# EAGLE design board (EAGLE 7.2.0)
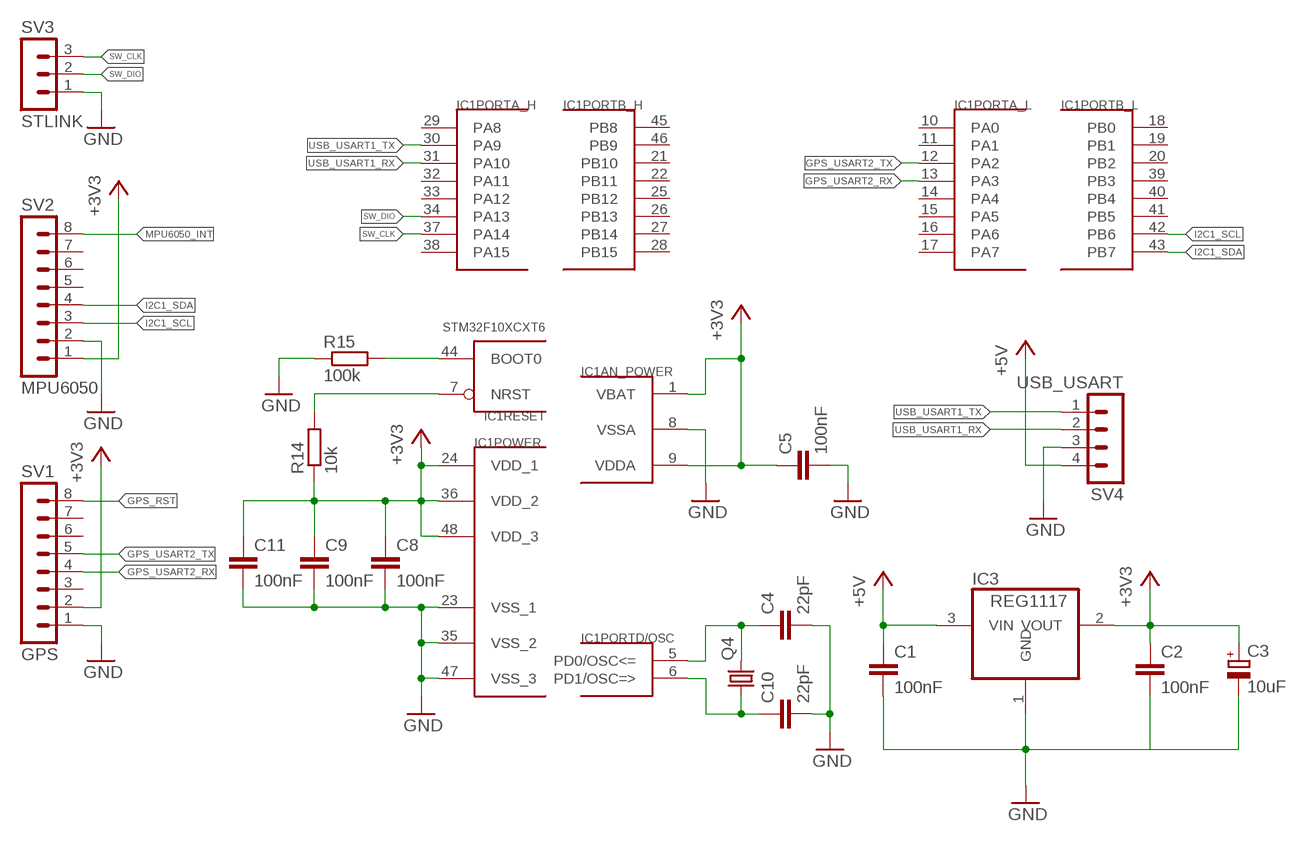
[diagram p0: schematic, sheet 1]

## Parts
C1  100nF  C-EUC0805  [C0805]
C2  100nF  C-EUC0805  [C0805]
C3  10uF  CPOL-EUC/6032-28W  [C/6032-28W]
C4  22pF  C-EUC0805  [C0805]
C5  100nF  C-EUC0603  [C0603]
C8  100nF  C-EUC0805  [C0805]
C9  100nF  C-EUC0805  [C0805]
C10  22pF  C-EUC0805  [C0805]
C11  100nF  C-EUC0805  [C0805]
IC1  STM32F10XCXT6  [TQFP48]
IC3  REG1117  [SOT223]
Q4  CRYSTALHC49UP  [HC49UP]
R14  10k  R-EU_M0805  [M0805]
R15  100k  R-EU_M0805  [M0805]
SV1  GPS  MA08-1  [MA08-1]
SV2  MPU6050  MA08-1  [MA08-1]
SV3  STLINK  MA03-1  [MA03-1]
SV4  USB_USART  MA04-1  [MA04-1]

## Nets
+3V3: C2.1 C3.+ C5.1 C8.1 C9.1 C11.1 IC1.1(AN_POWER:VBAT) IC1.9(AN_POWER:VDDA) IC1.24(POWER:VDD_1) IC1.36(POWER:VDD_2) IC1.48(POWER:VDD_3) IC3.2(VOUT) R14.1 SV1.2 SV2.1
+5V: C1.1 IC3.3(VIN) SV4.4
GND: C1.2 C2.2 C3.- C4.2 C5.2 C8.2 C9.2 C10.2 C11.2 IC1.8(AN_POWER:VSSA) IC1.23(POWER:VSS_1) IC1.35(POWER:VSS_2) IC1.47(POWER:VSS_3) IC3.1(GND) R15.1 SV1.1 SV2.2 SV3.1 SV4.3
GPS_RST: SV1.8
GPS_USART2_RX: IC1.13(PORTA_L:PA3) SV1.4
GPS_USART2_TX: IC1.12(PORTA_L:PA2) SV1.5
I2C1_SCL: IC1.42(PORTB_L:PB6) SV2.3
I2C1_SDA: IC1.43(PORTB_L:PB7) SV2.4
MPU6050_INT: SV2.8
N$3: C4.1 IC1.5(PORTD/OSC:PD0/OSC<=) Q4.2
N$13: IC1.7(RESET:NRST) R14.2
N$18: C10.1 IC1.6(PORTD/OSC:PD1/OSC=>) Q4.1
N$27: IC1.44(RESET:BOOT0) R15.2
SW_CLK: IC1.37(PORTA_H:PA14) SV3.3
SW_DIO: IC1.34(PORTA_H:PA13) SV3.2
USB_USART1_RX: IC1.31(PORTA_H:PA10) SV4.2
USB_USART1_TX: IC1.30(PORTA_H:PA9) SV4.1
Unconnected: IC1.2(PORTC:PC13) IC1.3(PORTC:PC14) IC1.4(PORTC:PC15) IC1.10(PORTA_L:PA0) IC1.11(PORTA_L:PA1) IC1.14(PORTA_L:PA4) IC1.15(PORTA_L:PA5) IC1.16(PORTA_L:PA6) IC1.17(PORTA_L:PA7) IC1.18(PORTB_L:PB0) IC1.19(PORTB_L:PB1) IC1.20(PORTB_L:PB2) IC1.21(PORTB_H:PB10) IC1.22(PORTB_H:PB11) IC1.25(PORTB_H:PB12) IC1.26(PORTB_H:PB13) IC1.27(PORTB_H:PB14) IC1.28(PORTB_H:PB15) IC1.29(PORTA_H:PA8) IC1.32(PORTA_H:PA11) IC1.33(PORTA_H:PA12) IC1.38(PORTA_H:PA15) IC1.39(PORTB_L:PB3) IC1.40(PORTB_L:PB4) IC1.41(PORTB_L:PB5) IC1.45(PORTB_H:PB8) IC1.46(PORTB_H:PB9) SV1.3 SV1.6 SV1.7 SV2.5 SV2.6 SV2.7

## Library data of the parts
C1 C2 C4 C5 C8-C11 = rcl:C-EU: CAPACITOR, European symbol
C3 = rcl:CPOL-EU: POLARIZED CAPACITOR, European symbol
IC1 = stm32:STM32F10XCXT6: ST STM32F101/103 48pin LQFP
IC3 = burr-brown:REG1117: 800mA and 1A Low Dropout (LDO) Positive Regulator 1.8V, 2.5V, 2.85V, 3.3V, 5V, and Adj; MPN: REG1117; OC_FARNELL: 1097566; OC_NEWARK: 14P6981
Q4 = crystal:CRYSTAL: CRYSTAL; OC_FARNELL: unknown; OC_NEWARK: unknown
R14 R15 = rcl:R-EU_: RESISTOR, European symbol
SV1 SV2 = con-lstb:MA08-1: PIN HEADER; OC_FARNELL: unknown; OC_NEWARK: unknown
SV3 = con-lstb:MA03-1: PIN HEADER; OC_FARNELL: unknown; OC_NEWARK: unknown
SV4 = con-lstb:MA04-1: PIN HEADER; OC_FARNELL: unknown; OC_NEWARK: unknown

## Board
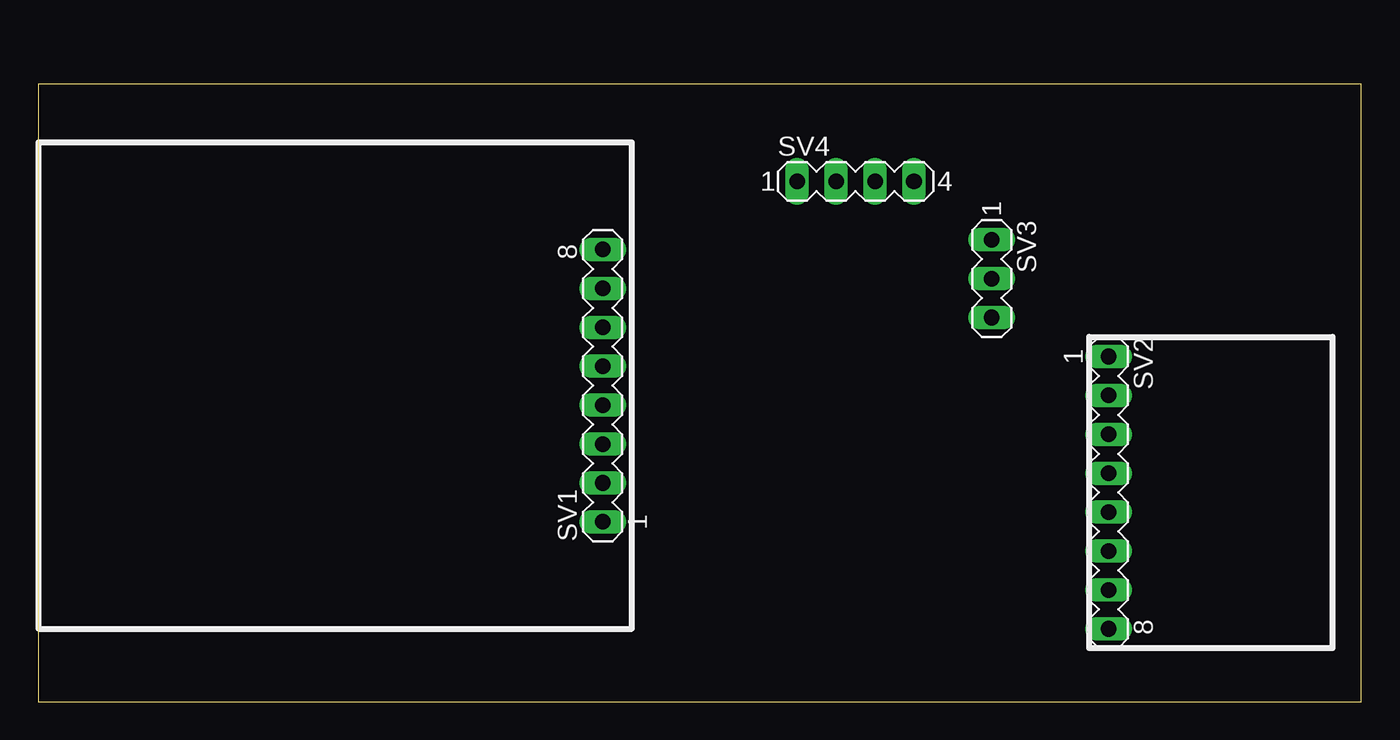
[diagram p1: board, top side]
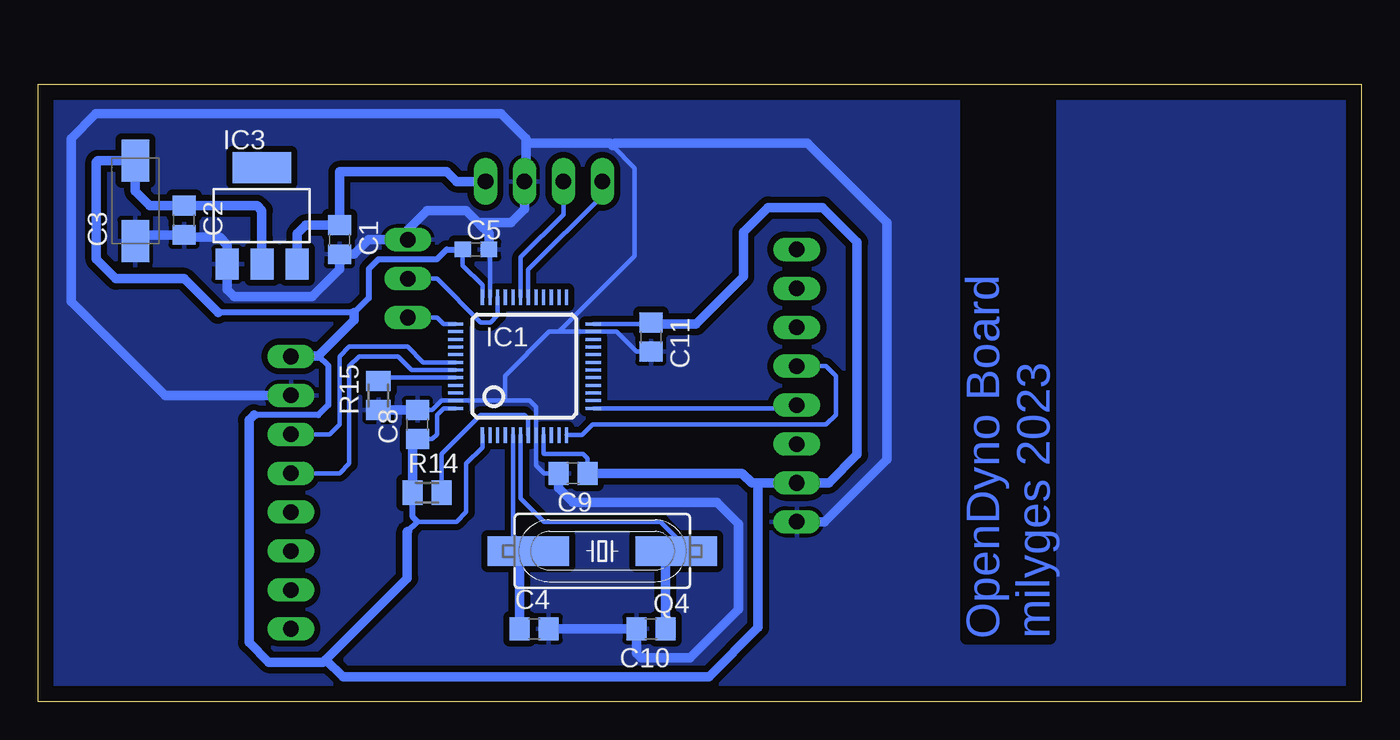
[diagram p2: board, bottom side, seen from below]

Size 86.34 x 40.32 mm. Coordinates in mm from the lower left corner, seen from the top.
Outline: 0,0 86.34,0 86.34,40.32 0,40.32 0,0
Copper layers (1*16): Top 0.035mm / dielectric 1.5mm / Bottom 0.035mm
Design rules "default": minimum track width 10mil, minimum drill 24mil, track to track 8mil, track to pad 8mil, pad to pad 8mil, via to via 8mil, smd to smd 8mil, copper to edge 40mil, drill to drill 8mil, minimum pad ring 10mil, minimum via ring 8mil, stop-mask expansion 4mil, vias tented up to drill 0mil, thermal gap 10mil

### Footprints (pad centres in the part's own frame; a part is rotated, then mirrored left to right if it is on the bottom)
C0805 = smd 1.3 x 1.5: 1 -0.95,0; 2 0.95,0
C/6032-28W = smd 2.75 x 1.8: + 2.625,0; - -2.625,0
C0603 = smd 1.1 x 1: 1 -0.85,0; 2 0.85,0
TQFP48 = smd 0.2 x 1: 1 -2.75,-4.5; 2 -2.25,-4.5; 3 -1.75,-4.5; 4 -1.25,-4.5; 5 -0.75,-4.5; 6 -0.25,-4.5; 7 0.25,-4.5; 8 0.75,-4.5; 9 1.25,-4.5; 10 1.75,-4.5; 11 2.25,-4.5; 12 2.75,-4.5; 25 2.75,4.5; 26 2.25,4.5; 27 1.75,4.5; 28 1.25,4.5; 29 0.75,4.5; 30 0.25,4.5; 31 -0.25,4.5; 32 -0.75,4.5; 33 -1.25,4.5; 34 -1.75,4.5; 35 -2.25,4.5; 36 -2.75,4.5 | smd 1 x 0.2: 13 4.5,-2.75; 14 4.5,-2.25; 15 4.5,-1.75; 16 4.5,-1.25; 17 4.5,-0.75; 18 4.5,-0.25; 19 4.5,0.25; 20 4.5,0.75; 21 4.5,1.25; 22 4.5,1.75; 23 4.5,2.25; 24 4.5,2.75; 37 -4.5,2.75; 38 -4.5,2.25; 39 -4.5,1.75; 40 -4.5,1.25; 41 -4.5,0.75; 42 -4.5,0.25; 43 -4.5,-0.25; 44 -4.5,-0.75; 45 -4.5,-1.25; 46 -4.5,-1.75; 47 -4.5,-2.25; 48 -4.5,-2.75
SOT223 = smd 1.499 x 2.007: 1 -2.261,-3.15; 2 0.025,-3.15; 3 2.311,-3.15 | smd 3.81 x 2.007: 4 0,3.15
HC49UP = smd 5.334 x 1.93: 1 -4.826,0; 2 4.826,0
M0805 = smd 1.3 x 1.6: 1 -0.95,0; 2 0.95,0
MA08-1 = drill 1.016 long: 1 -8.89,0; 2 -6.35,0; 3 -3.81,0; 4 -1.27,0; 5 1.27,0; 6 3.81,0; 7 6.35,0; 8 8.89,0
MA03-1 = drill 1.016 long: 1 -2.54,0; 2 0,0; 3 2.54,0
MA04-1 = drill 1.016 long: 1 -3.81,0; 2 -1.27,0; 3 1.27,0; 4 3.81,0

### Placement (x,y rotation side)
C1  66.67,30.16 270 bottom
C2  76.83,31.43 270 bottom
C3  80.01,32.7 90 bottom
C4  53.98,4.76 0 bottom
C5  57.78,29.52 0 bottom
C8  61.59,18.09 90 bottom
C9  51.44,14.92 180 bottom
C10  46.35,4.76 180 bottom
C11  46.35,23.81 270 bottom
IC1  54.61,21.9 0 bottom
IC3  71.75,31.72 0 bottom
Q4  49.53,9.84 180 bottom
R14  60.96,13.65 0 bottom
R15  64.14,20 90 bottom
SV1  36.83,20.63 90 top
SV2  69.85,13.65 270 top
SV3  62.23,27.62 270 top
SV4  53.34,33.97 0 top

### Tracks (layer width: path | path; a pad name or v marks a point on that pad's centre or on a via)
+3V3
  Bottom 0.305: IC1.36 57.36,27.19 58.63,28.47 C5.1 | IC1.9 53.36,16.21 53.34,16.19 50.8,16.19 50.48,15.87 C9.1 | IC1.1 57.36,16.61 58.42,15.55 58.42,12.38 59.05,11.74 61.59,11.74 | IC1.48 59.9,19.15 60.33,18.73 60.33,17.46 60.64,17.14 C8.1 | IC1.24 46.46,24.65 C11.1
  Bottom 0.406: R14.1 61.91,12.06 61.59,11.74 62.23,11.11 | 74.61,25.4 65.72,25.4 64.77,26.35 64.77,28.25 64.14,28.89 60.33,28.89 59.69,29.52 C5.1 | 68.06,22.58 67.42,21.94 67.42,19.35 68.06,18.71 72.26,18.71
  Bottom 0.61: C8.1 61.91,16.83 R14.1 | C3.+ 80.01,33.33 79.06,32.38 C2.1 72.07,32.38 71.75,32.06 71.75,30.21 IC3.2 | 74.61,25.4 76.83,27.62 81.28,27.62 82.55,28.89 82.55,35.24 82.47,35.32 C3.+ | C9.1 40.4,14.92 39.77,14.28 39.35,14.28 | 39.35,14.28 SV1.2 34.75,14.28 32.9,16.13 32.9,30 35.16,32.26 38.71,32.26 40.32,30.65 40.32,27.74 43.41,24.65 46.46,24.65 | C3.+ | 62.23,11.11 62.26,11.08 62.26,8.06 67.58,2.74 | SV2.1 69.81,22.58 68.06,22.58 65.72,24.92 65.72,25.4 | 72.26,18.71 72.58,18.39 72.58,3.87 71.29,2.58 67.74,2.58 67.58,2.74 | 39.35,14.28 39.35,4.84 42.58,1.61 66.45,1.61 67.58,2.74
+5V
  Bottom 0.61: SV4.4 59.05,33.97 59.69,34.6 66.67,34.6 C1.1 68.89,31.11 69.44,30.56 IC3.3
GND
  Bottom 0.305: IC1.35 56.86,29.45 C5.2 | C8.2 60.65,19.04 60.03,19.65 IC1.47 55.88,19.65 | C11.2 47.31,22.86 48.6,24.15 IC1.23 52.36,24.15 | 55.88,19.65 54.27,19.65 53.86,19.25 IC1.8 53.86,15.44 53.34,14.92 C9.2 | 52.36,24.15 52.99,24.15 55.88,21.27 55.88,19.65 | 52.36,24.15 47.42,29.09 47.42,34.84 48.87,36.29 49.03,36.45 | 54.61,35.71 SV4.3
  Bottom 0.61: C4.2 C10.2 47.3,3.17 46.99,2.85 43.81,2.85 40.65,6.02 40.65,11.61 42.05,13.01 51.44,13.01 52.38,13.96 C9.2 | C8.2 R15.1 | C3.- 79.61,30.48 C2.2 76.68,30.32 74.52,30.32 74.02,29.82 IC3.1 | 57.53,31.18 58.42,32.06 60.96,32.06 62.23,30.79 SV3.1 64.77,30.16 65.72,29.21 C1.2 66.67,28.25 68.48,26.45 73.55,26.45 74.02,26.92 IC3.1 | 57.53,31.18 56.94,30.58 C5.2 | 74.02,28.61 IC3.1 | 57.53,31.18 57.42,31.29 55.48,31.29 54.61,32.16 SV4.3 54.52,34.06 54.52,36.45 | SV1.1 35.03,11.74 30.97,15.81 30.97,31.29 36.13,36.45 48.71,36.45 48.87,36.29 | SV2.2 78.06,20 84.19,26.13 84.19,36.77 82.58,38.39 56.13,38.39 54.52,36.77 54.52,36.45 | 49.03,36.45 54.52,36.45
  pour Bottom (isolate 0.406): 0,40.34 86.36,40.34 86.36,-0.96 0,-0.96
GPS_USART2_RX
  Bottom 0.305: IC1.13 37.04,19.15 SV1.4
GPS_USART2_TX
  Bottom 0.305: IC1.12 50.85,17.4 50.16,18.09 34.92,18.09 34.29,18.73 34.29,21.27 34.92,21.9 SV1.5
I2C1_SCL
  Bottom 0.305: IC1.42 61.21,22.15 62.23,23.17 66.04,23.17 66.67,22.54 66.67,18.09 67.31,17.46 SV2.3
I2C1_SDA
  Bottom 0.305: IC1.43 61.98,21.65 62.87,22.54 65.41,22.54 66.04,21.9 66.04,15.55 66.67,14.92 SV2.4
N$3
  Bottom 0.305: IC1.5 55.36,10.84 Q4.2
  Bottom 0.61: C4.1 54.92,9.27 Q4.2
N$13
  Bottom 0.305: IC1.7 54.36,18.48 54.61,18.73 57.47,18.73 60.01,16.19 R14.2
N$18
  Bottom 0.305: IC1.6 54.86,13.26 53.34,11.74 45.72,11.74 44.7,10.73 Q4.1
  Bottom 0.61: C10.1 45.41,9.14 Q4.1
N$27
  Bottom 0.305: IC1.44 63.93,21.15 R15.2
SW_CLK
  Bottom 0.305: IC1.37 59.9,24.65 60.33,25.08 SV3.3
SW_DIO
  Bottom 0.305: IC1.34 56.36,25.24 56.84,24.77 57.47,24.77 60.33,27.62 SV3.2
USB_USART1_RX
  Bottom 0.305: IC1.31 54.86,29.01 52.07,31.8 SV4.2
USB_USART1_TX
  Bottom 0.305: IC1.30 54.36,28.22 49.53,33.05 SV4.1

### Text on the board
Bottom: OpenDyno Board / milyges 2023
tValues: GPS